# EAGLE design Altimeter (EAGLE 7.1.0)

## Sheet 1 of 5
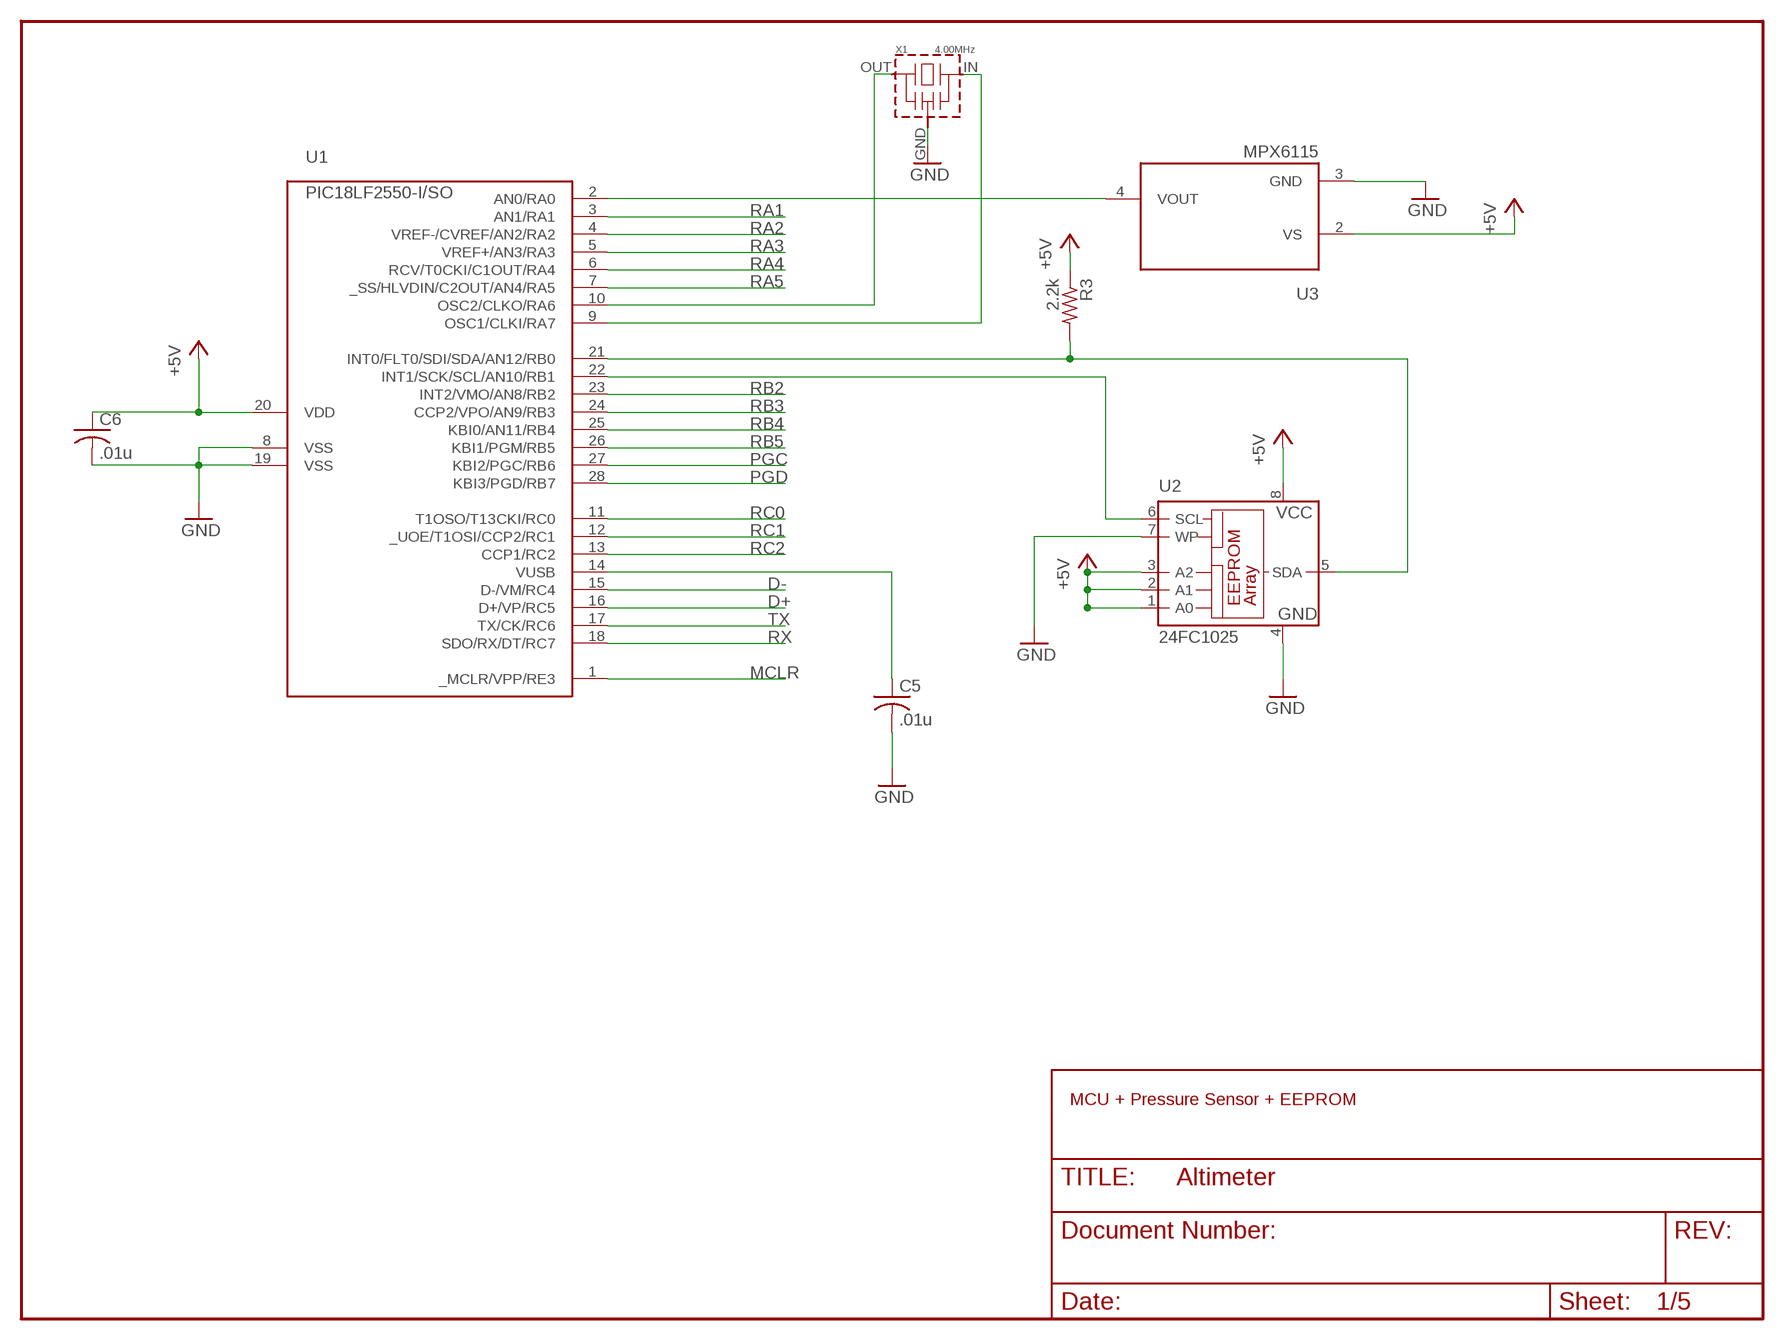
[diagram p0: schematic, sheet 1]

### Parts
C5  .01u  C-USC1206  [C1206]
C6  .01u  C-USC1206  [C1206]
R3  2.2k  R-US_R1206  [R1206]
U1  PIC18LF2550-I/SO  [SO-28W]
U2  24FC1025  24LC128SM  [SO-08M]
U3  MPX6115  [SSOP8]
X1  4.00MHz  CERAMIC_RES  [7434]

### Nets
+5V: C6.1 R3.1 U1.20(VDD) U2.1(A0) U2.2(A1) U2.3(A2) U2.8(VCC) U3.2(VS) ; also sheet 3,5
D+: U1.16(D+/VP/RC5) ; also sheet 3
D-: U1.15(D-/VM/RC4) ; also sheet 3
GND: C5.2 C6.2 U1.8(VSS) U1.19(VSS) U2.4(GND) U2.7(WP) U3.3(GND) X1.GND(VSS) ; also sheet 2,3,4,5
MCLR: U1.1(_MCLR/VPP/RE3) ; also sheet 3
N$1: U1.2(AN0/RA0) U3.4(VOUT)
N$2: U1.22(INT1/SCK/SCL/AN10/RB1) U2.6(SCL)
N$3: R3.2 U1.21(INT0/FLT0/SDI/SDA/AN12/RB0) U2.5(SDA)
N$4: U1.10(OSC2/CLKO/RA6) X1.OUT
N$5: U1.9(OSC1/CLKI/RA7) X1.IN
N$17: C5.1 U1.14(VUSB)
PGC: U1.27(KBI2/PGC/RB6) ; also sheet 3
PGD: U1.28(KBI3/PGD/RB7) ; also sheet 3
RA1: U1.3(AN1/RA1)
RA2: U1.4(VREF-/CVREF/AN2/RA2)
RA3: U1.5(VREF+/AN3/RA3) ; also sheet 2
RA4: U1.6(RCV/T0CKI/C1OUT/RA4) ; also sheet 2
RA5: U1.7(_SS/HLVDIN/C2OUT/AN4/RA5)
RB2: U1.23(INT2/VMO/AN8/RB2) ; also sheet 4
RB3: U1.24(CCP2/VPO/AN9/RB3) ; also sheet 4
RB4: U1.25(KBI0/AN11/RB4)
RB5: U1.26(KBI1/PGM/RB5)
RC0: U1.11(T1OSO/T13CKI/RC0) ; also sheet 4
RC1: U1.12(_UOE/T1OSI/CCP2/RC1) ; also sheet 4
RC2: U1.13(CCP1/RC2) ; also sheet 4
RX: U1.18(SDO/RX/DT/RC7) ; also sheet 3
TX: U1.17(TX/CK/RC6) ; also sheet 3

### Notes on the sheet
- MCU + Pressure Sensor + EEPROM

## Sheet 2 of 5
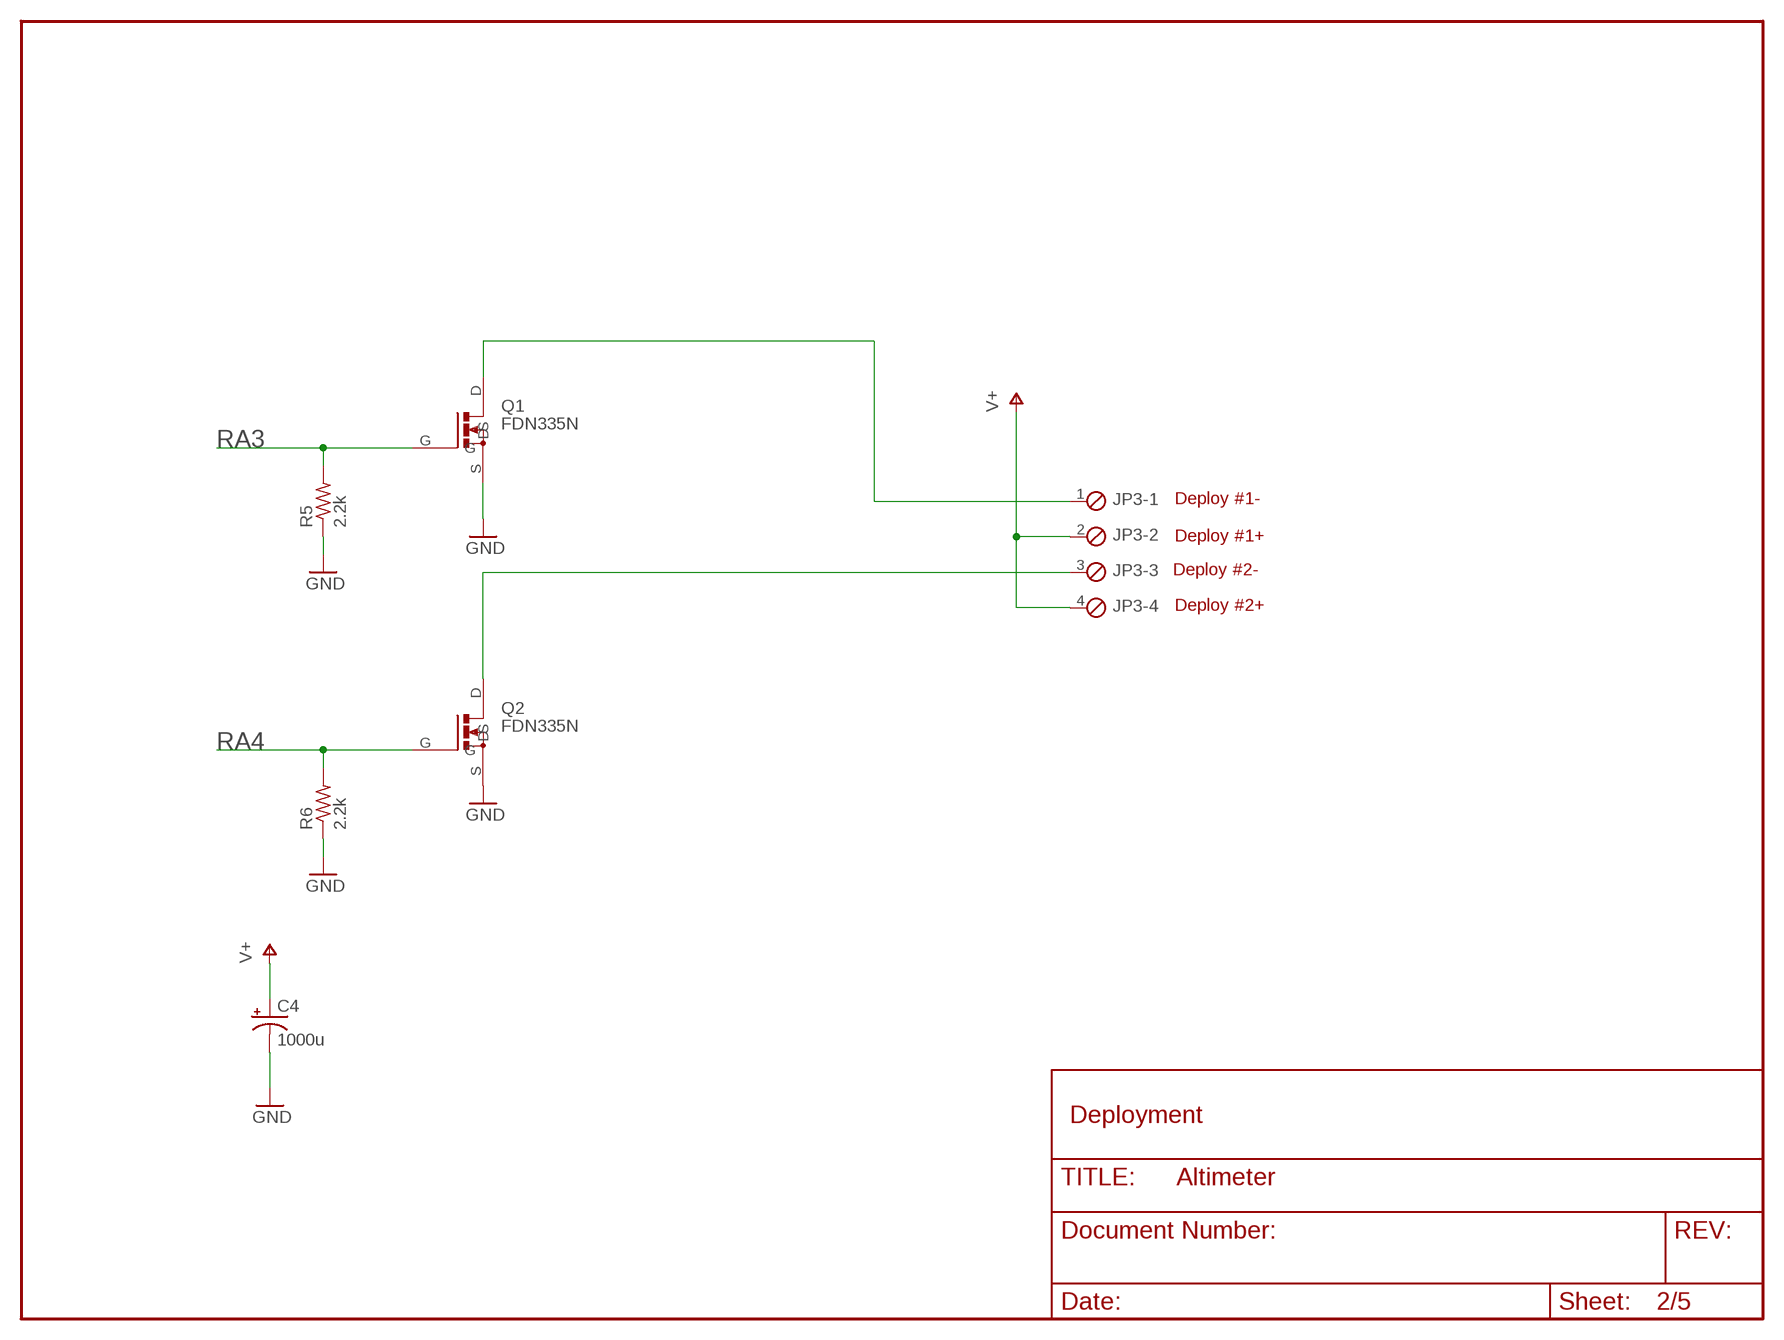
[diagram p1: schematic, sheet 2]

### Parts
C4  1000u  CPOL-USG  [PANASONIC_G]
JP3  MPT4  [4POL254]
Q1  FDN335N  [SSOT3]
Q2  FDN335N  [SSOT3]
R5  2.2k  R-US_R1206  [R1206]
R6  2.2k  R-US_R1206  [R1206]

### Nets
GND: C4.- Q1.S Q2.S R5.1 R6.1 ; also sheet 1,3,4,5
N$6: JP3.1 Q1.D
N$7: JP3.3 Q2.D
RA3: Q1.G R5.2 ; also sheet 1
RA4: Q2.G R6.2 ; also sheet 1
V+: C4.+ JP3.2 JP3.4 ; also sheet 5

### Notes on the sheet
- Deploy #1-
- Deploy #1+
- Deploy #2-
- Deploy #2+
- Deployment

## Sheet 3 of 5
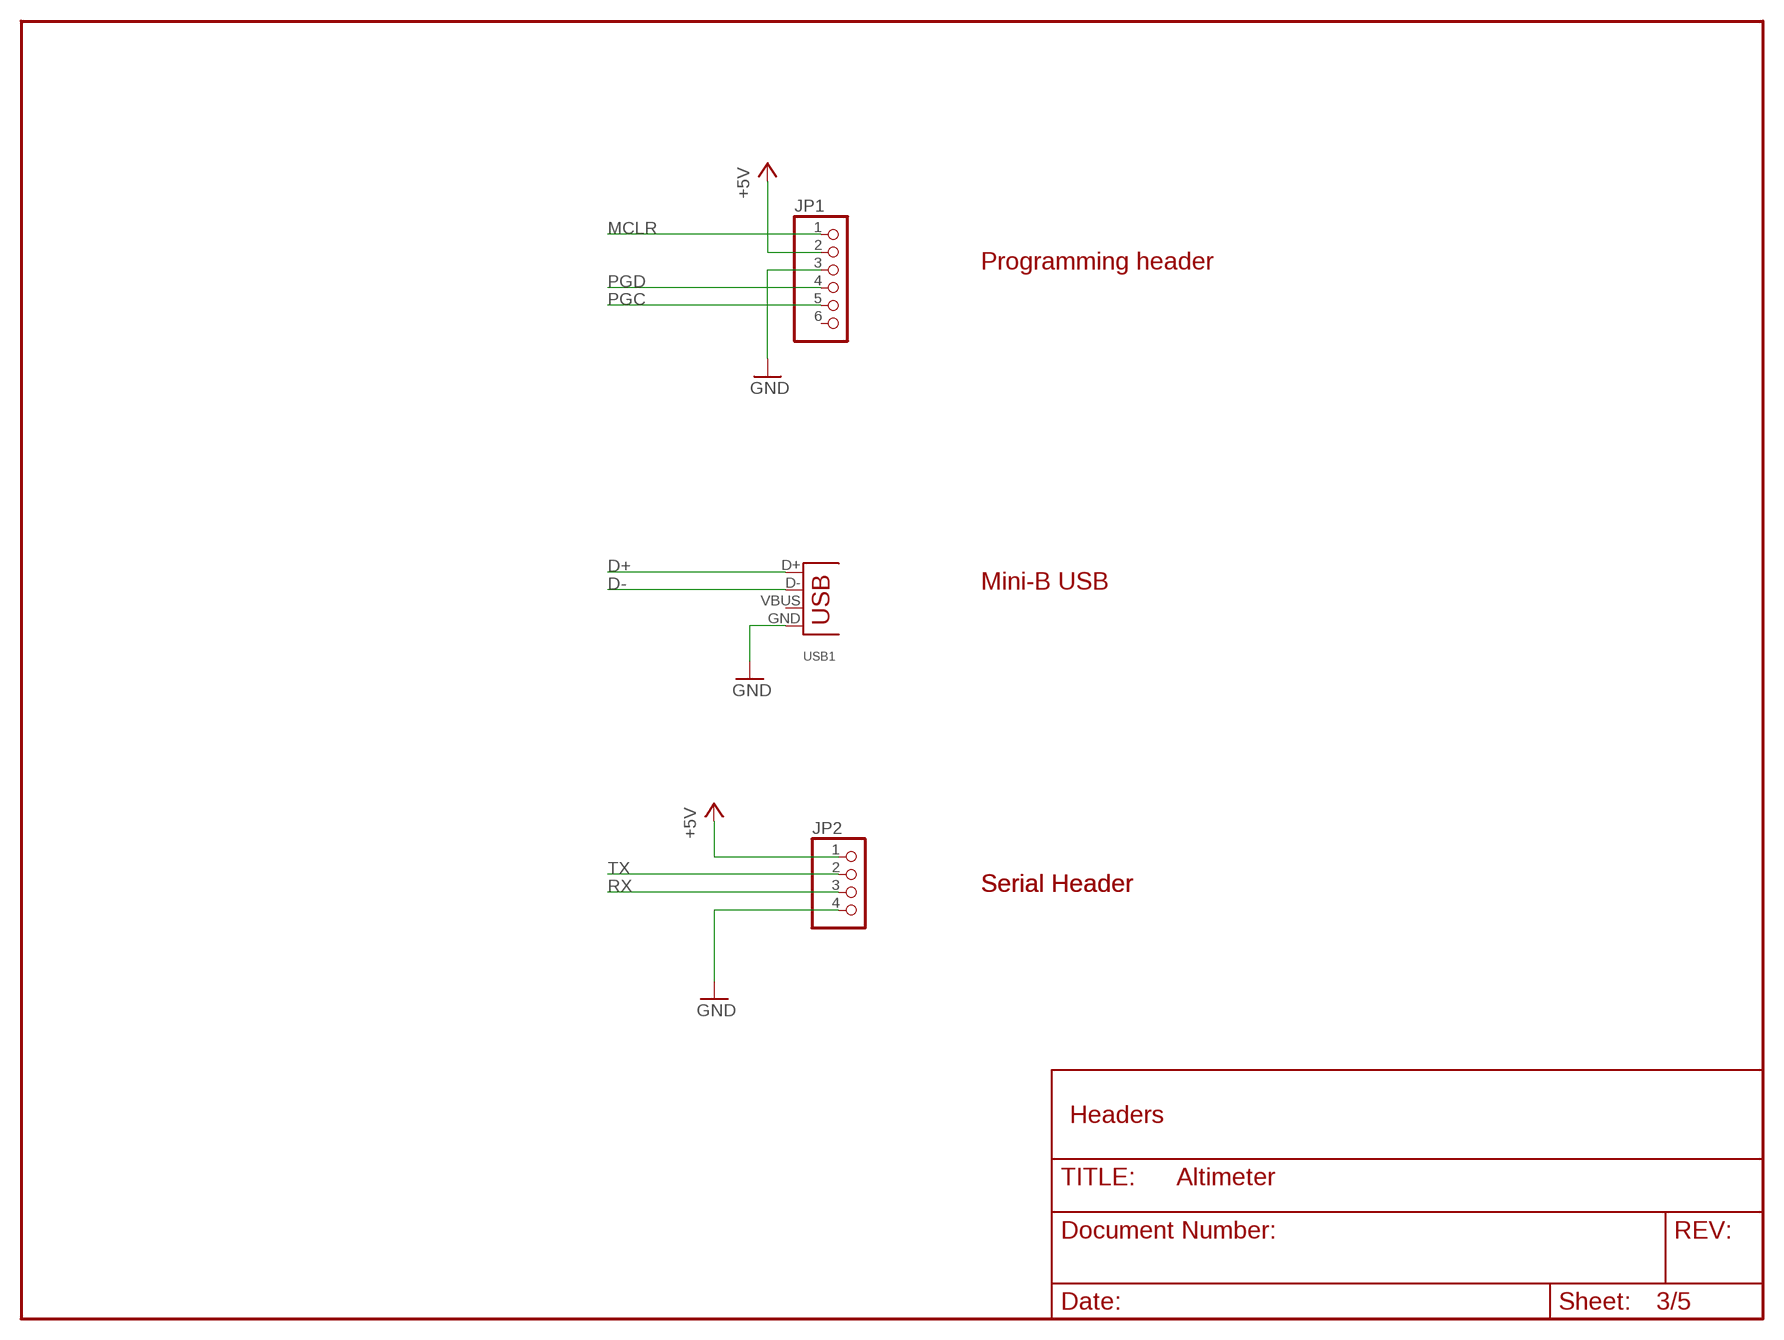
[diagram p2: schematic, sheet 3]

### Parts
JP1  PINHD-1X6  [1X06]
JP2  PINHD-1X4  [1X04]
USB1  USB-MB-S  [USB-MB-S]

### Nets
+5V: JP1.2 JP2.1 ; also sheet 1,5
D+: USB1.D+ ; also sheet 1
D-: USB1.D- ; also sheet 1
GND: JP1.3 JP2.4 USB1.GND ; also sheet 1,2,4,5
MCLR: JP1.1 ; also sheet 1
PGC: JP1.5 ; also sheet 1
PGD: JP1.4 ; also sheet 1
RX: JP2.3 ; also sheet 1
TX: JP2.2 ; also sheet 1
Unconnected: JP1.6 USB1.VBUS

### Notes on the sheet
- Programming header
- Mini-B USB
- Serial Header | Serial Header
- Headers

## Sheet 4 of 5
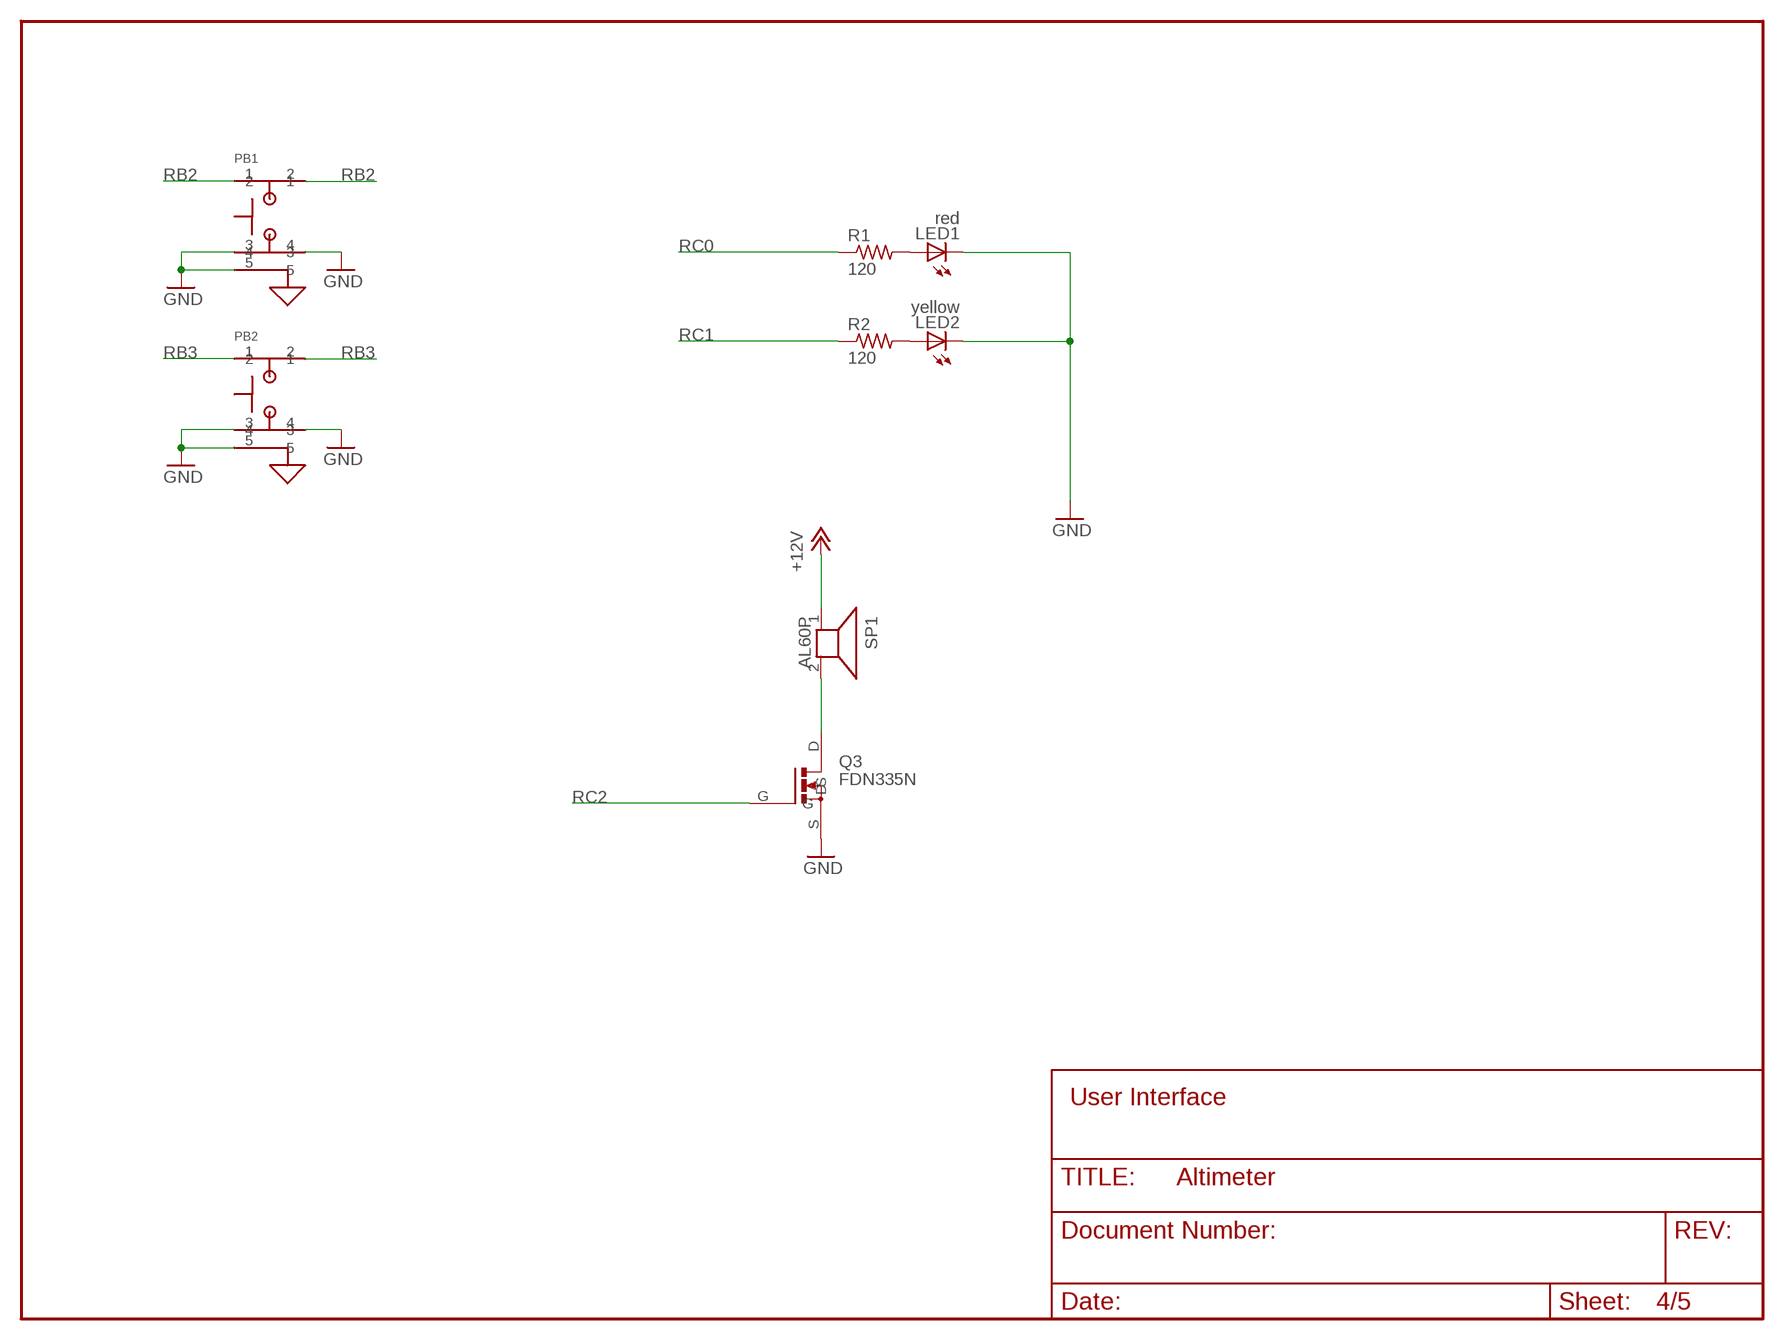
[diagram p3: schematic, sheet 4]

### Parts
LED1  red  LEDSMT1206  [1206]
LED2  yellow  LEDSMT1206  [1206]
PB1  ALPS_SWITCH_SMD  [ALPS-SMD-TACT]
PB2  ALPS_SWITCH_SMD  [ALPS-SMD-TACT]
Q3  FDN335N  [SSOT3]
R1  120  R-US_R1206  [R1206]
R2  120  R-US_R1206  [R1206]
SP1  AL60P  [KB-BUZZER]

### Nets
+12V: SP1.1 ; also sheet 5
GND: LED1.C LED2.C PB1.3 PB1.4 PB1.5 PB2.3 PB2.4 PB2.5 Q3.S ; also sheet 1,2,3,5
N$12: LED1.A R1.2
N$13: LED2.A R2.2
N$15: Q3.D SP1.2
RB2: PB1.1 PB1.2 ; also sheet 1
RB3: PB2.1 PB2.2 ; also sheet 1
RC0: R1.1 ; also sheet 1
RC1: R2.1 ; also sheet 1
RC2: Q3.G ; also sheet 1

### Notes on the sheet
- User Interface

## Sheet 5 of 5
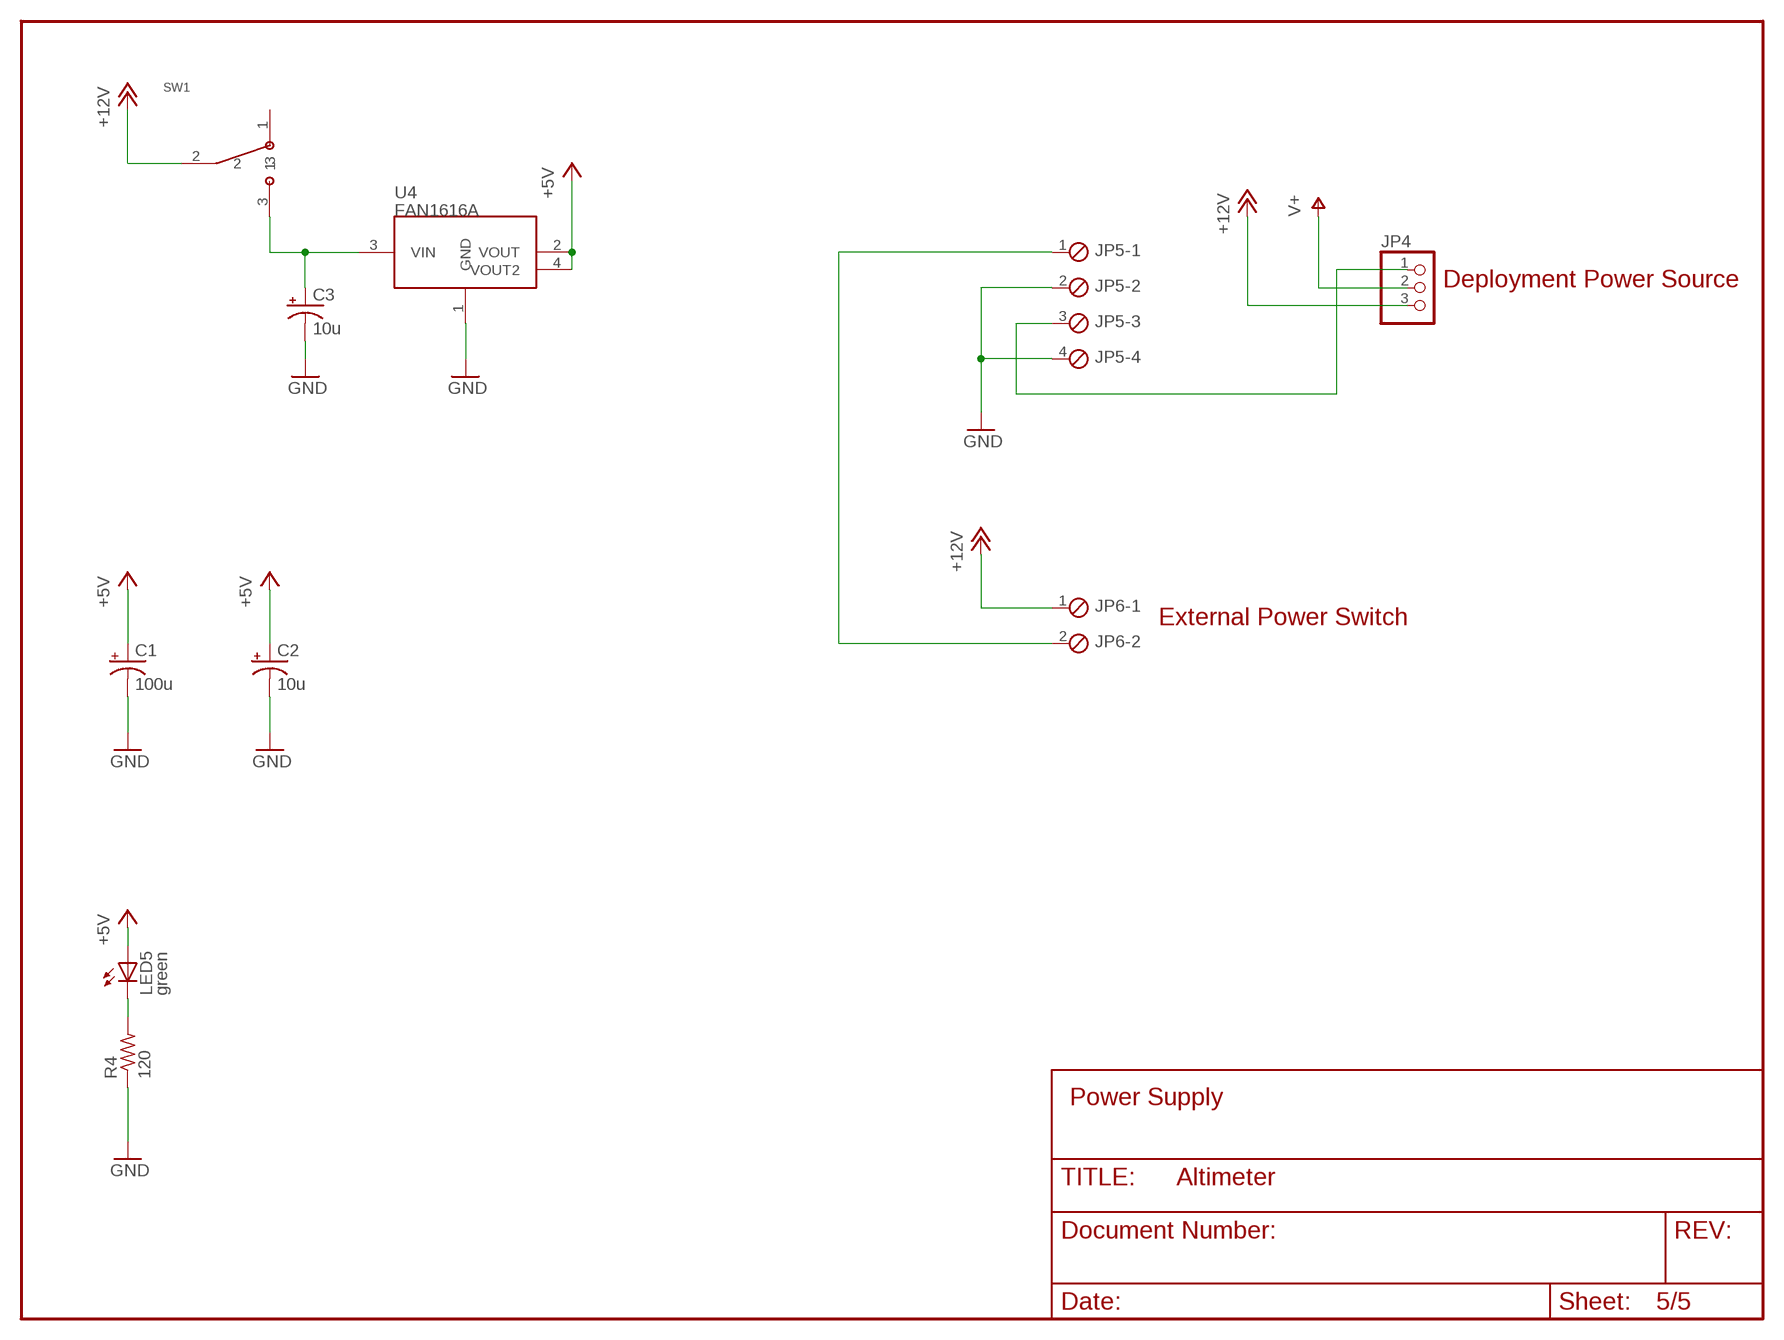
[diagram p4: schematic, sheet 5]

### Parts
C1  100u  CPOL-USD  [PANASONIC_D]
C2  10u  CPOL-USC  [PANASONIC_C]
C3  10u  CPOL-USC  [PANASONIC_C]
JP4  PINHD-1X3  [1X03]
JP5  MPT4  [4POL254]
JP6  MPT2  [2POL254]
LED5  green  LEDSMT1206  [1206]
R4  120  R-US_R1206  [R1206]
SW1  EG1218  [EG-SWITCH]
U4  FAN1616A  [SOT223]

### Nets
+5V: C1.+ C2.+ LED5.A U4.2(VOUT) U4.4(VOUT2) ; also sheet 1,3
+12V: JP4.3 JP6.1 SW1.2 ; also sheet 4
GND: C1.- C2.- C3.- JP5.2 JP5.4 R4.1 U4.1(GND) ; also sheet 1,2,3,4
N$8: C3.+ SW1.3 U4.3(VIN)
N$9: JP5.1 JP6.2
N$10: JP4.1 JP5.3
N$16: LED5.C R4.2
V+: JP4.2 ; also sheet 2
Unconnected: SW1.1

### Notes on the sheet
- Deployment Power Source
- External Power Switch
- Power Supply

## Library data of the parts
C1-C3 = rcl:CPOL-US: POLARIZED CAPACITOR, American symbol
C4 = rcl-2:CPOL-US: POLARIZED CAPACITOR, American symbol
C5 C6 = rcl:C-US: CAPACITOR, American symbol
JP1 = pinhead:PINHD-1X6: PIN HEADER
JP2 = pinhead:PINHD-1X4: PIN HEADER
JP3 JP5 = con-phoenix-254:MPT4: PHOENIX CONNECTOR
JP4 = pinhead:PINHD-1X3: PIN HEADER
JP6 = con-phoenix-254:MPT2: PHOENIX CONNECTOR
LED1 LED2 LED5 = led:LED: LED OSRAM: - CHIPLED LG R971, LG N971, LY N971, LG Q971, LY Q971, LO R971, LY R971 LH N974, LH R974 LS Q976, LO Q976, LY Q976 LO Q996 - Hyper CHIPLED LW Q18S LB Q993, LB Q99A, LB R99A - SideLED LS A670, LO A670, LY A670, LG A670, LP A670 LB A673, LV A673, LT A673, LW A673 LH A674 LY A675 LS A676, LA A676, LO A676, LY A676, LW A676 LS A679, LY A679, LG A679 - Hyper Micro SIDELED® LS Y876, LA Y876, LO Y876, LY Y876 LT Y87S - SmartLED LW L88C, LW L88S LB L89C, LB L89S, LG L890 LS L89K, LO L89K, LY L89K LS L896, LA L896, LO L896, LY L896 - TOPLED LS T670, LO T670, LY T670, LG T670, LP T670 LSG T670, LSP T670, LSY T670, LOP T670, LYG T670 LG T671, LOG T671, LSG T671 LB T673, LV T673, LT T673, LW T673 LH T674 LS T676, LA T676, LO T676, LY T676, LB T676, LH T676, LSB T676, LW T676 LB T67C, LV T67C, LT T67C, LS T67K, LO T67K, LY T67K, LW E67C LS E67B, LA E67B, LO E67B, LY E67B, LB E67C, LV E67C, LT E67C LW T67C LS T679, LY T679, LG T679 LS T770, LO T770, LY T770, LG T770, LP T770 LB T773, LV T773, LT T773, LW T773 LH T774 LS E675, LA E675, LY E675, LS T675 LS T776, LA T776, LO T776, LY T776, LB T776 LHGB T686 LT T68C, LB T68C - Hyper Mini TOPLED® LB M676 - Mini TOPLED Santana® LG M470 LS M47K, LO M47K, LY M47K Source: http://www.osram.convergy.de - LUMILED® LXK2-PW12-R00, LXK2-PW12-S00, LXK2-PW14-U00, LXK2-PW14-V00 LXK2-PM12-R00, LXK2-PM12-S00, LXK2-PM14-U00 LXK2-PE12-Q00, LXK2-PE12-R00, LXK2-PE12-S00, LXK2-PE14-T00, LXK2-PE14-U00 LXK2-PB12-K00, LXK2-PB12-L00, LXK2-PB12-M00, LXK2-PB14-N00, LXK2-PB14-P00, LXK2-PB14-Q00 LXK2-PR12-L00, LXK2-PR12-M00, LXK2-PR14-Q00, LXK2-PR14-R00 LXK2-PD12-Q00, LXK2-PD12-R00, LXK2-PD12-S00 LXK2-PH12-R00, LXK2-PH12-S00 LXK2-PL12-P00, LXK2-PL12-Q00, LXK2-PL12-R00 Source: www.luxeon.com
PB1 PB2 = altimeter-parts:ALPS_SWITCH_SMD
Q1-Q3 = altimeter-parts:FDN335N: N-CHANNEL MOS FET SYMBOL
R1-R6 = rcl:R-US_: RESISTOR, American symbol
SP1 = altimeter-parts:AL60P: SPEAKER Source: Buerklin
SW1 = altimeter-parts:EG1218
U1 = microchip-pic18fxx5x:PIC18*2550: PIC18*2550 Microchip FLASH Microcontroller with FS-USB DEVICE FEATURES Feature PIC18*2550 Program Memory (bytes) 32k Program Memory (instructions) 16384 I/O Ports Ports A, B, C, (E) Capture/Compare/PWM Modules 2 Enhanced Capture/Compare/PWM Modules 0 Parallel Communications (PSP) No 10-bit Analog-to-Digital Module 10 input Channels Package Types 28-pin PDIP 28-pin SOIC NOTES: F only after 18, means standard voltage range from 4.2v to 5.5v LF after 18, means extended voltage range from 2.0v to 5.5v T after entire device number, means supplied in tape and reel TQFP packages only -E before / denotes extended temperature range from -40°C to +120°C -I before / denotes industrial temperature range from -40°C to +85°C /PT suffix denotes TQFP package /SO suffix denotes SOIC package /SP suffix denotes Skinny Plastic DIP package /P suffix denotes Plastic DIP package /ML suffix denotes QFN package
U2 = microchip:24*: Serial EEPROM I2C
U3 = altimeter-parts:MPX6115: Pressure sensor
U4 = altimeter-parts:FAN1616A
USB1 = con-usb-3:USB: USB Connectors
X1 = altimeter-parts:CERAMIC_RES: Ceramic resonator 2.00 to 10.00 MHz

## Net classes
0 default: drill 1.016 mm

## Board
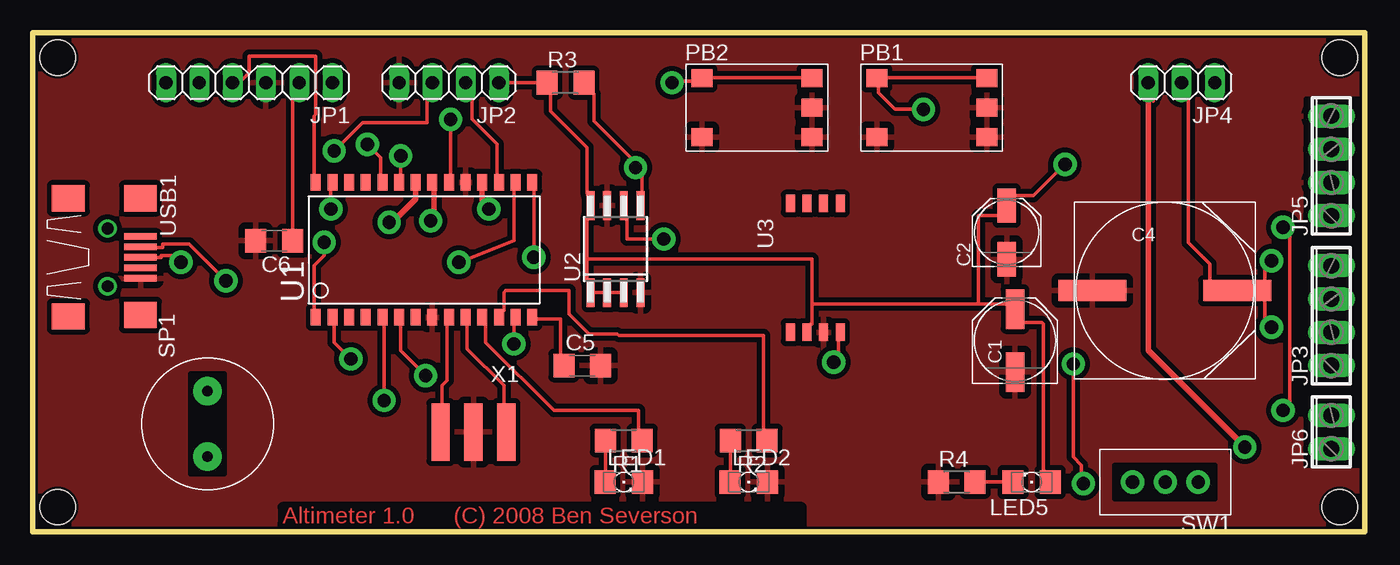
[diagram p5: board, top side]
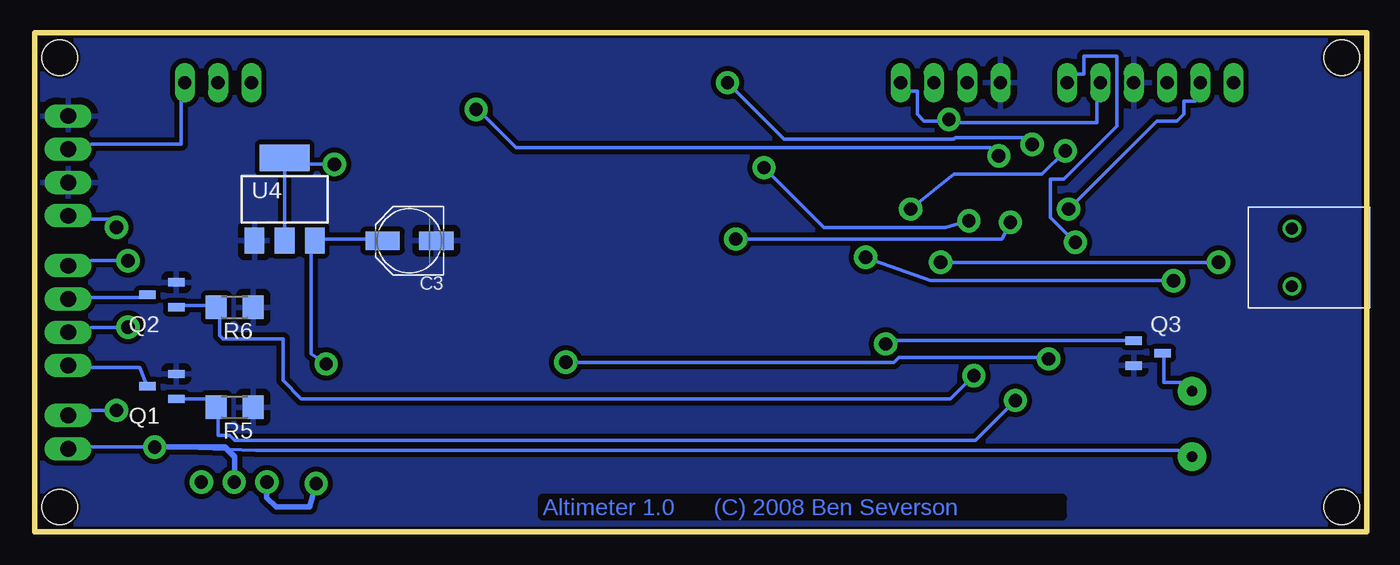
[diagram p6: board, bottom side, seen from below]

Size 101.6 x 38.1 mm. Coordinates in mm from the lower left corner, seen from the top.
Outline: 101.6,0 101.6,38.1 0,38.1 0,0 101.6,0
Copper layers (1*16): Top 0.035mm / dielectric 1.5mm / Bottom 0.035mm
Design rules "default": minimum track width 10mil, minimum drill 30mil, track to track 15mil, track to pad 15mil, pad to pad 8mil, via to via 30mil, smd to smd 8mil, copper to edge 8mil, drill to drill 20mil, minimum pad ring 10mil, minimum via ring 15mil, stop-mask expansion 4mil, vias tented up to drill 0mil, thermal gap 20mil
Holes 2.71 mm at 1.91,36.2 99.69,36.2 99.69,1.91 1.91,1.91
tRestrict: area 97.2,5.1 to 101,33; area 82.5,2.5 to 90.2,5.1; area 12.1,4.4 to 14.6,12.1
vRestrict: area 41.9,19.1 to 47,26.7; area 40.6,1.9 to 57.8,8.9; area 57.1,14.6 to 62.2,26; area 71.1,10.8 to 78.1,18.4; area 71.1,19.7 to 77.5,26; area 79.4,10.8 to 93.3,25.4; area 50.2,29.2 to 73.7,35.6; area 8.9,33 to 36.8,35.6; area 41.9,17.1 to 47,19.1; area 0,14.6 to 10.2,26.7; area 96.5,3.8 to 101,33.7; area 83.8,32.4 to 91.4,36.2; 1 more areas

### Footprints (pad centres in the part's own frame; a part is rotated, then mirrored left to right if it is on the bottom)
PANASONIC_D = smd 3 x 1.4: + 2.4,0; - -2.4,0
PANASONIC_C = smd 2.6 x 1.4: + 2.05,0; - -2.05,0
PANASONIC_G = smd 5.2 x 1.6: + 5.52,0; - -5.52,0
C1206 = smd 1.6 x 1.8: 1 -1.4,0; 2 1.4,0
1X06 = drill 1.016 long: 1 -6.35,0; 2 -3.81,0; 3 -1.27,0; 4 1.27,0; 5 3.81,0; 6 6.35,0
1X04 = drill 1.016 long: 1 -3.81,0; 2 -1.27,0; 3 1.27,0; 4 3.81,0
4POL254 = drill 1.2 long: 1 -3.81,0; 2 -1.27,0; 3 1.27,0; 4 3.81,0
1X03 = drill 1.016 long: 1 -2.54,0; 2 0,0; 3 2.54,0
2POL254 = drill 1.2 long: 1 -1.27,0; 2 1.27,0
1206 = smd 1.6 x 1.803: A -1.422,0; C 1.422,0
ALPS-SMD-TACT = smd 1.6 x 1.4: 1 -4.2,2.25; 2 4.2,2.25; 3 -4.2,-2.25; 4 4.2,-2.25; 5 4.2,0
SSOT3 = smd 1.27 x 0.635: D 2.21,0.94; G 0,1.905; S 0,0
R1206 = smd 1.6 x 1.8: 1 -1.4,0; 2 1.4,0
KB-BUZZER = drill 0.8 pad 2.184: 1 -2.5,0; 2 2.5,0
EG-SWITCH = drill 1 pad 1.778: 1 0,0; 2 2.5,0; 3 5,0
SO-28W = smd 0.762 x 1.27: 1 -7.62,-5.207; 2 -6.35,-5.207; 3 -5.08,-5.207; 4 -3.81,-5.207; 5 -2.54,-5.207; 6 -1.27,-5.207; 7 0,-5.207; 8 1.27,-5.207; 9 2.54,-5.207; 10 3.81,-5.207; 11 5.08,-5.207; 12 6.35,-5.207; 13 7.62,-5.207; 14 8.89,-5.207; 15 8.89,5.08; 16 7.62,5.08; 17 6.35,5.08; 18 5.08,5.08; 19 3.81,5.08; 20 2.54,5.08; 21 1.27,5.08; 22 0,5.08; 23 -1.27,5.08; 24 -2.54,5.08; 25 -3.81,5.08; 26 -5.08,5.08; 27 -6.35,5.08; 28 -7.62,5.08
SO-08M = smd 0.6 x 2.2: 1 -1.905,-3.33; 2 -0.635,-3.33; 3 0.635,-3.33; 4 1.905,-3.33; 5 1.905,3.33; 6 0.635,3.33; 7 -0.635,3.33; 8 -1.905,3.33
SSOP8 = smd 1.346 x 0.686: 1 0,3.81; 2 0,2.54; 3 0,1.27; 4 0,0; 5 9.83,0; 6 9.83,1.27; 7 9.83,2.54; 8 9.83,3.81
SOT223 = smd 1.5 x 2: 1 -2.3,-3.15; 2 0,-3.15; 3 2.3,-3.15 | smd 3.8 x 2: 4 0,3.15
USB-MB-S = smd 2.5 x 0.5: D+ 2.5,0; D- 2.5,0.8; GND 2.5,-1.6; ID 2.5,-0.8; VBUS 2.5,1.6 | smd 2.5 x 2: P$1 -3,-4.5; P$2 -3,4.5; P$3 2.5,-4.4; P$4 2.5,4.5 | drill 0.9: P$5 0,2.2; P$6 0,-2.2
7434 = smd 1.4 x 4.4: GND 2.5,0; IN 0,0; OUT 5,0

### Placement (x,y rotation side)
C1  74.93,14.61 90 top
C2  74.3,22.86 90 top
C3  73.03,22.23 180 bottom
C4  86.36,18.41 0 top
C5  41.91,12.7 0 top
C6  18.41,22.23 180 top
JP1  16.51,34.29 180 top
JP2  31.75,34.29 180 top
JP3  99.06,16.51 90 top
JP4  87.63,34.29 180 top
JP5  99.06,27.94 90 top
JP6  99.06,7.62 90 top
LED1  45.09,3.81 0 top
LED2  54.61,3.81 0 top
LED5  76.2,3.81 180 top
PB1  68.58,32.38 0 top
PB2  55.24,32.38 0 top
Q1  90.81,12.06 180 bottom
Q2  90.81,19.05 180 bottom
Q3  17.78,12.7 0 bottom
R1  45.09,6.99 180 top
R2  54.61,6.99 180 top
R3  40.64,34.29 0 top
R4  70.48,3.81 0 top
R5  86.36,9.53 180 bottom
R6  86.36,17.14 180 bottom
SP1  13.34,8.26 90 top
SW1  88.9,3.81 180 top
U1  29.21,21.59 0 top
U2  44.45,21.59 0 top
U3  61.59,15.24 90 top
U4  82.55,25.4 0 bottom
USB1  5.71,20.95 0 top
X1  31.11,7.62 0 top

### Tracks (layer width: path | path; a pad name or v marks a point on that pad's centre or on a via)
+5V  (via drill 1.02)
  Top 0.254: C6.1 19.81,23.11 19.81,33.02 JP1.2 | U2.3 44.83,18.29 44.07,18.29 U2.2 43.56,18.29 42.8,18.29 U2.1 42.29,19.3 42.29,20.83 | 42.29,20.83 42.29,23.88 U2.8 42.29,25.91 42.29,29.34 39.5,32.13 39.5,33.4 R3.1 JP2.1 | v31.88,31.5 31.88,27.18 U1.20 | 59.5,17.34 59.56,17.4 72.14,17.4 | 59.5,17.34 59.44,17.27 59.44,15.88 59.31,15.88 U3.2 | 72.14,17.4 74.3,17.4 C1.+ 75.56,16 76.96,16 77.09,15.88 77.09,4.7 LED5.A | 72.14,17.4 72.14,24.13 73.66,24.13 C2.+ 74.93,25.65 76.33,25.65 v78.74,28.07 | 42.29,20.83 59.44,20.83 59.44,17.4 59.5,17.34
  Bottom 0.254: JP2.1 34.92,33.66 34.29,33.66 34.29,31.88 33.78,31.37 32,31.37 v31.88,31.5 31.11,31.24 20.57,31.24 20.57,32.89 JP1.2 | U4.2 U4.4 80.77,28.07 v78.74,28.07
+12V  (via drill 1.02)
  Top 0.254: 85.47,32.89 85.41,33.11 JP4.3
  Top 0.406: 85.41,33.11 85.33,33.02 85.09,33.02 85.09,13.84 v92.46,6.48
  Bottom 0.254: JP6.1 97.28,6.48 v92.46,6.48 84.71,6.22 14.35,6.22 SP1.1
  Bottom 0.406: v92.46,6.48 87.12,6.48 86.36,5.71 86.36,3.81 SW1.2
D+  (via drill 1.02)
  Top 0.254: v32.51,20.57 36.7,22.23 36.7,26.16 U1.16 | v11.3,20.57 10.79,21.08 9.78,21.08 9.78,20.95 USB1.D+
  Bottom 0.254: v11.3,20.57 v32.51,20.57
D-  (via drill 1.02)
  Top 0.254: v38.23,20.95 38.23,26.16 U1.15 | v14.73,19.18 11.94,21.97 9.91,21.97 9.91,21.72 9.4,21.72 USB1.D-
  Bottom 0.254: v38.23,20.95 33.27,19.18 v14.73,19.18
GND
  pour Top: 101.6,38.1 101.6,0.64 101.6,0
  pour Bottom: 0,38.1 101.6,38.1 101.6,0 0,0
  pour Top: 0,38.1 101.6,38.1 101.6,0 0,0
MCLR  (via drill 1.02)
  Top 0.254: v22.23,22.1 22.23,21.08 21.46,20.32 21.46,16.89 U1.1
  Bottom 0.254: v22.23,22.1 24.13,24 24.13,26.92 23.11,26.92 19.05,30.99 19.05,36.32 21.59,36.32 21.59,34.92 22.23,34.92 JP1.1
N$1  (via drill 1.02)
  Top 0.254: v24.26,13.21 22.99,14.48 22.99,15.88 U1.2 | v61.09,12.95 61.47,13.34 61.47,14.61 U3.4
  Bottom 0.254: v24.26,13.21 24.38,13.34 35.69,13.34 36.07,12.95 v61.09,12.95
N$2  (via drill 1.02)
  Top 0.254: v48.13,22.35 45.34,22.35 45.34,23.88 U2.6
  Top 0.406: U1.22 29.21,25.4 27.3,23.5 v27.18,23.62
  Bottom 0.254: v27.18,23.62 27.81,22.35 v48.13,22.35
N$3  (via drill 1.02)
  Top 0.254: v30.35,23.75 30.61,24.77 | 30.61,26.16 U1.21 | U2.5 46.48,25.91 46.48,27.3 v45.97,27.81 45.59,28.57 42.8,31.37 42.8,33.4 R3.2
  Top 0.406: v30.35,23.75 30.35,24 30.61,24.26 30.61,26.16
  Bottom 0.254: v30.35,23.75 32.13,23.24 41.4,23.24 v45.97,27.81
N$4
  Top 0.254: U1.10 33.15,15.88 33.15,13.97 35.94,11.18 35.94,9.78 X1.OUT
N$5
  Top 0.254: U1.9 31.62,15.88 31.62,11.56 31.24,11.18 31.24,9.78 X1.IN
N$6
  Bottom 0.254: Q1.D 93.6,12.57 97.28,12.57 JP3.1
N$7
  Bottom 0.254: Q2.D 93.6,17.91 97.28,17.91 JP3.3
N$8  (via drill 1.02)
  Top 0.254: v79.38,12.83 79.38,5.71 80.01,5.08 80.01,3.81 v80.14,3.68
  Bottom 0.254: C3.+ 76.33,22.35 79.5,22.35 U4.3 80.52,21.34 80.52,13.59 v79.38,12.83
  Bottom 0.406: SW1.3 83.9,2.62 83.19,1.91 80.64,1.91 v80.14,3.68
N$9  (via drill 1.02)
  Top 0.254: v95.38,9.27 95.89,9.78 95.89,22.73 v95.38,23.24
  Bottom 0.254: v95.38,9.27 97.28,9.27 JP6.2 | v95.38,23.24 96.01,23.88 97.28,23.88 JP5.1
N$10
  Bottom 0.254: JP4.1 90.42,32.89 90.42,29.59 97.28,29.59 JP5.3
N$12
  Top 0.254: R1.2 43.69,6.1 43.69,4.7 LED1.A
N$13
  Top 0.254: R2.2 53.21,6.1 53.21,4.7 LED2.A
N$15
  Bottom 0.254: Q3.D 15.49,13.34 15.49,11.43 14.1,11.43 SP1.2
N$16
  Top 0.254: R4.2 LED5.C
N$17
  Top 0.254: U1.14 38.35,16.26 40.26,16.26 40.26,13.59 C5.1
PGC  (via drill 1.02)
  Top 0.254: v22.73,24.64 22.73,26.16 U1.27
  Bottom 0.254: v22.73,24.64 16,31.37 14.48,31.37 13.97,31.88 13.97,32.89 13.08,32.89 JP1.5
PGD
  Top 0.254: U1.28 21.46,27.18 21.46,31.75 21.59,31.88 21.59,36.32 16.51,36.32 16.51,35.05 15.88,34.42 JP1.4
RA3  (via drill 1.02)
  Top 0.254: v26.8,10.03 26.8,15.88 U1.5
  Bottom 0.254: R5.2 88.39,10.16 Q1.G | 87.63,9.53 87.63,7.37 86.74,7.37 86.36,6.99 29.84,6.99 v26.8,10.03 26.67,10.16
  Bottom 0.406: 87.63,9.53 R5.2
RA4  (via drill 1.02)
  Top 0.254: v29.97,11.94 28.07,13.84 28.07,15.88 U1.6
  Bottom 0.254: Q2.G 90.3,17.27 88.52,17.27 R6.2 87.5,16.26 87.5,14.99 87.25,14.73 82.68,14.73 82.68,11.56 81.28,10.16 31.75,10.16 v29.97,11.94 29.84,12.06
RB2  (via drill 1.02)
  Top 0.254: v28.07,28.7 28.07,27.18 U1.23 | PB1.2 72.01,34.67 65.15,34.67 PB1.1 64.38,34.68 | v67.94,32.26 65.79,32.26 64.52,33.53 64.52,34.54 64.38,34.68 | 64.38,34.68 64.14,34.92
  Bottom 0.254: v28.07,28.7 28.7,29.34 64.9,29.34 67.94,32.38 v67.94,32.26
RB3  (via drill 1.02)
  Top 0.254: v25.53,29.59 26.54,28.57 26.54,27.18 U1.24 | v48.77,34.29 48.9,34.42 50.29,34.42 PB2.1 51.82,34.67 58.67,34.67 PB2.2
  Bottom 0.254: v25.53,29.59 26.04,30.1 31.37,30.1 31.5,29.97 44.45,29.97 v48.77,34.29
RC0
  Top 0.254: U1.11 34.54,15.88 34.54,14.48 39.75,9.27 46.23,9.27 46.23,7.87 R1.1
RC1
  Top 0.254: U1.12 35.81,16.89 35.94,16.89 35.94,18.29 36.07,18.41 40.89,18.41 40.89,16.64 42.42,15.11 44.58,15.11 44.7,14.99 55.75,14.99 55.75,7.87 R2.1
RC2  (via drill 1.02)
  Top 0.254: v36.7,14.35 36.7,15.88 U1.13
  Bottom 0.254: v36.7,14.35 36.45,14.61 Q3.G
RX  (via drill 1.02)
  Top 0.254: v22.99,29.08 25.15,31.24 30.1,31.24 30.1,32.89 JP2.3 | U1.18 34.16,26.16
  Top 0.406: v34.8,24.64 34.29,24.77 U1.18
  Bottom 0.254: v34.8,24.64 31.5,27.3 24.77,27.3 v22.99,29.08
TX
  Top 0.254: U1.17 35.43,27.18 35.43,29.59 33.53,31.5 33.53,33.02 JP2.2
V+  (via drill 1.02)
  Top 0.254: JP4.2 88.14,33.02 88.14,22.1 89.79,20.45 89.79,19.18 C4.+ | v94.49,15.62 93.98,16.13 93.98,17.65 C4.+ | v94.49,20.7 93.98,20.7 93.98,19.18 C4.+
  Bottom 0.254: v94.49,15.62 97.28,15.62 JP3.2 | v94.49,20.7 97.28,20.7 JP3.4

### Text on the board
Top: Altimeter 1.0 (C) 2008 Ben Severson
Bottom: Altimeter 1.0 (C) 2008 Ben Severson